# Altium schematic sheet Power_Unit.SchDoc
size A4; SheetNumber: 1; SheetTotal: 4
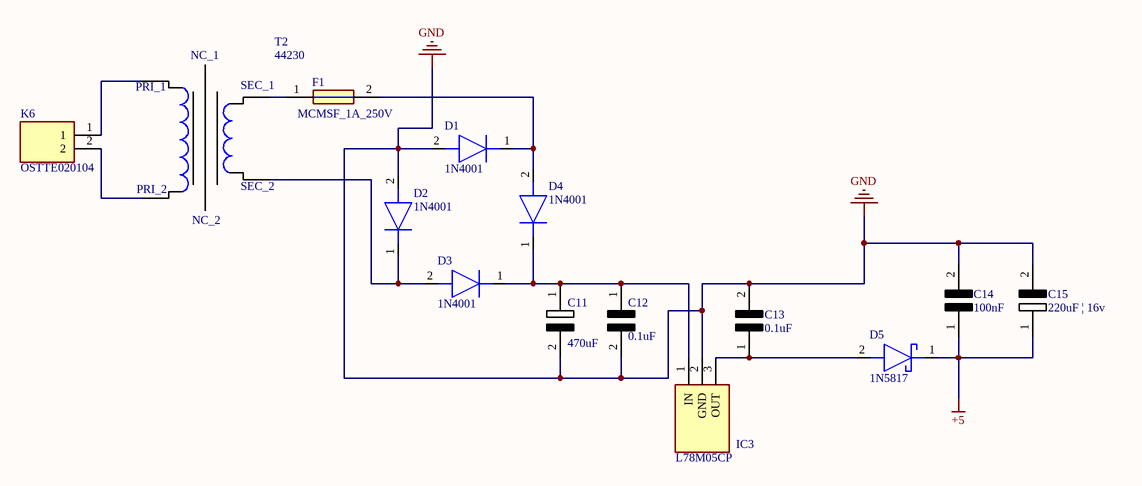
[diagram p0: Power_Unit.SchDoc]

## Parts
C11  470uF  [C0805]
C12  0.1uF  [C0805]
C13  0.1uF  [C0805]
C14  100nF  [C0805]
C15  220uF | 16v  [C0805]
D1  1N4001  [DIOAD1405W86L465D235]
D2  1N4001  [DIOAD1405W86L465D235]
D3  1N4001  [DIOAD1405W86L465D235]
D4  1N4001  [DIOAD1405W86L465D235]
D5  1N5817  [1n5817_footprint]
F1  MCMSF_1A_250V  [MCMSF1A250V]
IC3  L78M05CP  [TO255P460X1020X2030-3P]
K6  OSTTE020104  [OSTTE020104]
T2  44230  [44230]

## Nets
+5: C14.1 C15.1 D5.1(K)
GND: C11.2 C12.2 C13.2 C14.2 C15.2 D1.2(A) D2.2(A) IC3.2(GND)
NetC11_1: C11.1 C12.1 D3.1(K) D4.1(K) IC3.1(IN)
NetC13_1: C13.1 D5.2(A) IC3.3(OUT)
NetD1_1: D1.1(K) D4.2(A) F1.2
NetD2_1: D2.1(K) D3.2(A) T2.9(SEC_2)
NetF1_1: F1.1 T2.7(SEC_1)
NetK6_1: K6.1 T2.1(PRI_1)
NetK6_2: K6.2 T2.5(PRI_2)

Not connected (* = marked no-connect by the designer): T2 6(NC_1) 10(NC_2)

## Library data of the parts
C11 C15 = elektrolytischeC0805: 0805 ceramic capacitor; Manufacturer_Name: Murata Electronics; Manufacturer_Part_Number: GRM188R71H103KA01D; Datasheet Link: https://datasheet.datasheetarchive.com/originals/distributors/Datasheets_SAMA/ec4f1577dddcc7a13ddad897a28002d3.pdf; Height: 0.9mm; Mouser Part Number: 81-GRM39X103K50D; Mouser Price/Stock: https://www.mouser.co.uk/ProductDetail/Murata-Electronics/GRM188R71H103KA01D?qs=WWniysbtxULrL2ljbViAbw%3D%3D; Arrow Part Number: GRM188R71H103KA01D; Arrow Price/Stock: https://www.arrow.com/en/products/grm188r71h103ka01d/murata-manufacturing?region=europe
C12-C14 = KeramischeC0805_1: 0805 ceramic capacitor; Manufacturer_Name: Murata Electronics; Manufacturer_Part_Number: GRM188R71H103KA01D; Datasheet Link: https://datasheet.datasheetarchive.com/originals/distributors/Datasheets_SAMA/ec4f1577dddcc7a13ddad897a28002d3.pdf; Height: 0.9mm; Mouser Part Number: 81-GRM39X103K50D; Mouser Price/Stock: https://www.mouser.co.uk/ProductDetail/Murata-Electronics/GRM188R71H103KA01D?qs=WWniysbtxULrL2ljbViAbw%3D%3D; Arrow Part Number: GRM188R71H103KA01D; Arrow Price/Stock: https://www.arrow.com/en/products/grm188r71h103ka01d/murata-manufacturing?region=europe
D1-D4 = 1N4001: Diode; Manufacturer_Name: Vishay; Datasheet Link: https://www.vishay.com/docs/88503/1n4001.pdf; Manufacturer_Part_Number: 1N4001
D5 = 1N5817: Schottky Diode; Manufacturer_Name: Rectron; Datasheet Link: https://www.arrow.com/en/products/1n5817/rectron; Manufacturer_Part_Number: 1N5817; Arrow Part Number: 1N5817; Arrow Price/Stock: https://www.arrow.com/en/products/1n5817/rectron?region=nac
F1 = MCMSF_1A_250V: Fuse; Manufacturer_Name: Multicomp Pro; Manufacturer_Part_Number: MCMSF 1A 250V; Datasheet Link: https://componentsearchengine.com/Datasheets/2/MCMSF%201A%20250V.pdf; Height: 7.7mm
IC3 = L78M05CP: Integrated Circuit; Manufacturer_Name: STMicroelectronics; Datasheet Link: http://www.st.com/web/en/resource/technical/document/datasheet/CD00000447.pdf; Height: 4.6mm; Manufacturer_Part_Number: L78M05CP; Mouser Part Number: 511-L78M05CP; Mouser Price/Stock: https://www.mouser.co.uk/ProductDetail/STMicroelectronics/L78M05CP?qs=W%252B4obUA0F3anQylSbAkrfw%3D%3D; Arrow Part Number: L78M05CP; Arrow Price/Stock: https://www.arrow.com/en/products/l78m05cp/stmicroelectronics?region=europe
K6 = OSTTE020104: Connector; Manufacturer_Name: On Shore Technology Inc.; Datasheet Link: https://datasheet.datasheetarchive.com/originals/dk/DKDS-18/336634.pdf; Height: 8.7mm; Manufacturer_Part_Number: OSTTE020104
T2 = 44230: Transformer; Manufacturer_Name: MYRRA; Datasheet Link: https://componentsearchengine.com/Datasheets/2/44230.pdf; Height: 32.8mm; Manufacturer_Part_Number: 44230; Arrow Part Number: 44230; Arrow Price/Stock: https://www.arrow.com/en/products/44230/myrra?region=europe